# EAGLE design ADS7822 (EAGLE 6.5.0)

## Sheet 1 of 2

## Sheet 2 of 2
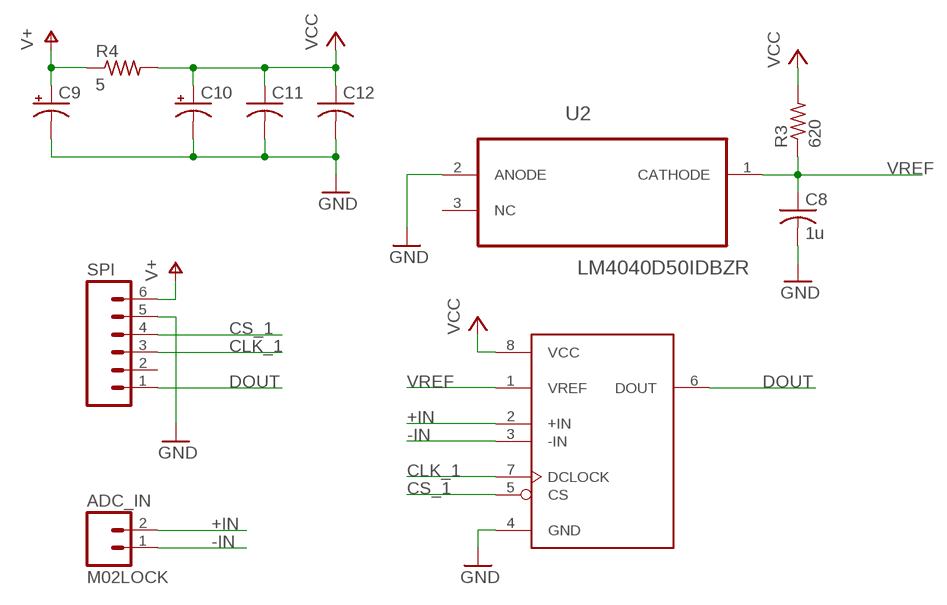
[diagram p0: schematic, sheet 2]

### Parts
ADC_IN  M02LOCK  [1X02_LOCK]
C8  1u  C-USC0805  [C0805]
C9  CPOL-US  [SMD_6.6X6.6]
C10  CPOL-US  [SMD_6.6X6.6]
C11  C-USC0805  [C0805]
C12  C-USC0805  [C0805]
R3  620  R-US_R0805  [R0805]
R4  5  R-US_R1206  [R1206]
SPI  M06LOCK  [1X06_LOCK]
U2  LM4040D50IDBZR  [SOT95P237X112-3N]
U$3  ADS7822  [SO-08]

### Nets
+IN: ADC_IN.2 U$3.2(+IN)
-IN: ADC_IN.1 U$3.3(-IN)
CLK_1: SPI.3 U$3.7(DCLOCK)
CS_1: SPI.4 U$3.5(CS)
DOUT: SPI.1 U$3.6(DOUT)
GND: C8.2 C9.- C10.- C11.2 C12.2 SPI.5 U2.2(ANODE) U$3.4(GND)
V+: C9.+ R4.1 SPI.6
VCC: C10.+ C11.1 C12.1 R3.2 R4.2 U$3.8(VCC)
VREF: C8.1 R3.1 U2.1(CATHODE) U$3.1(VREF)
Unconnected: SPI.2 U2.3(NC)

## Library data of the parts
ADC_IN = SparkFun-Connectors:M02: Standard 2-pin 0.1" header. Use with - straight break away headers ( PRT-00116) - right angle break away headers (PRT-00553) - swiss pins (PRT-00743) - machine pins (PRT-00117) - female headers (PRT-00115) Molex polarized connector foot print use with: PRT-08233 with associated crimp pins and housings. 2.54_SCREWTERM for use with PRT-10571. 3.5mm Screw Terminal footprints for PRT-08084 5mm Screw Terminal footprints for use with PRT-08432
C8 C11 C12 = rcl:C-US: CAPACITOR, American symbol
C9 C10 = rcl:CPOL-US: POLARIZED CAPACITOR, American symbol
R3 R4 = rcl:R-US_: RESISTOR, American symbol
SPI = SparkFun-Connectors:M06: Header 6 Standard 6-pin 0.1" header. Use with straight break away headers (SKU : PRT-00116), right angle break away headers (PRT-00553), swiss pins (PRT-00743), machine pins (PRT-00117), and female headers (PRT-00115). Molex polarized connector foot print use with SKU : PRT-08094 with associated crimp pins and housings. NOTES ON THE VARIANTS LOCK and LOCK_LONGPADS... This footprint was designed to help hold the alignment of a through-hole component (i.e. 6-pin header) while soldering it into place. You may notice that each hole has been shifted either up or down by 0.005 of an inch from it's more standard position (which is a perfectly straight line). This slight alteration caused the pins (the squares in the middle) to touch the edges of the holes. Because they are alternating, it causes a "brace" to hold the component in place. 0.005 has proven to be the perfect amount of "off-center" position when using our standard breakaway headers. Although looks a little odd when you look at the bare footprint, once you have a header in there, the alteration is very hard to notice. Also,if you push a header all the way into place, it is covered up entirely on the bottom side. This idea of altering the position of holes to aid alignment will be further integrated into the Sparkfun Library for other footprints. It can help hold any component with 3 or more connection pins.
U2 = LM4040-5.0_SOIC:LM4040D50IDBZR: PRECISION MICROPOWER SHUNT VOLTAGE REFERENCE; MPN: LM4040D50IDBZR; OC_FARNELL: 1652239; OC_NEWARK: 43K3367; PACKAGE: 3-SOT-23; SUPPLIER: TEXAS INSTRUMENTS
U$3 = texas:ADS7822

## Board
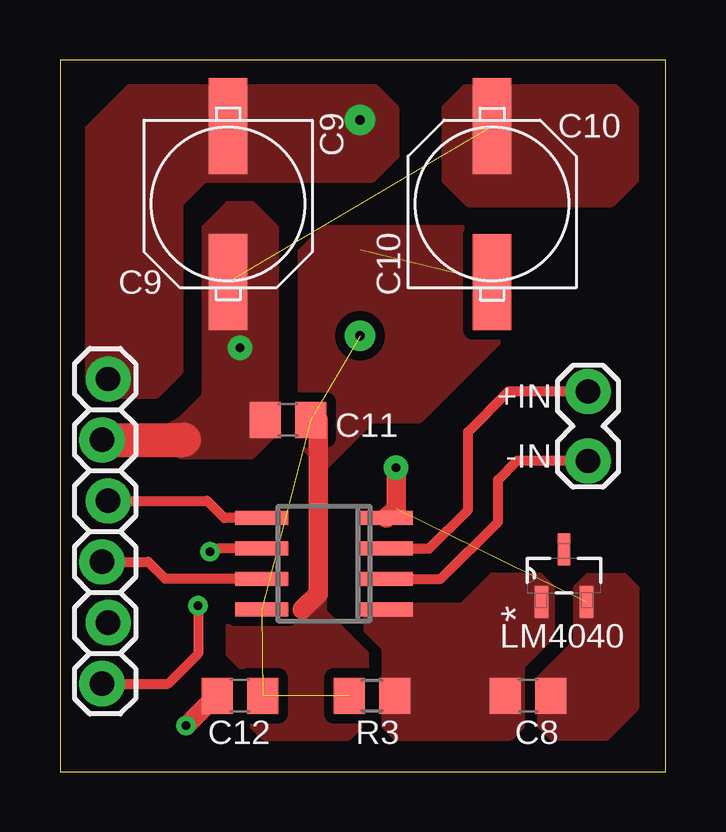
[diagram p1: board, top side]
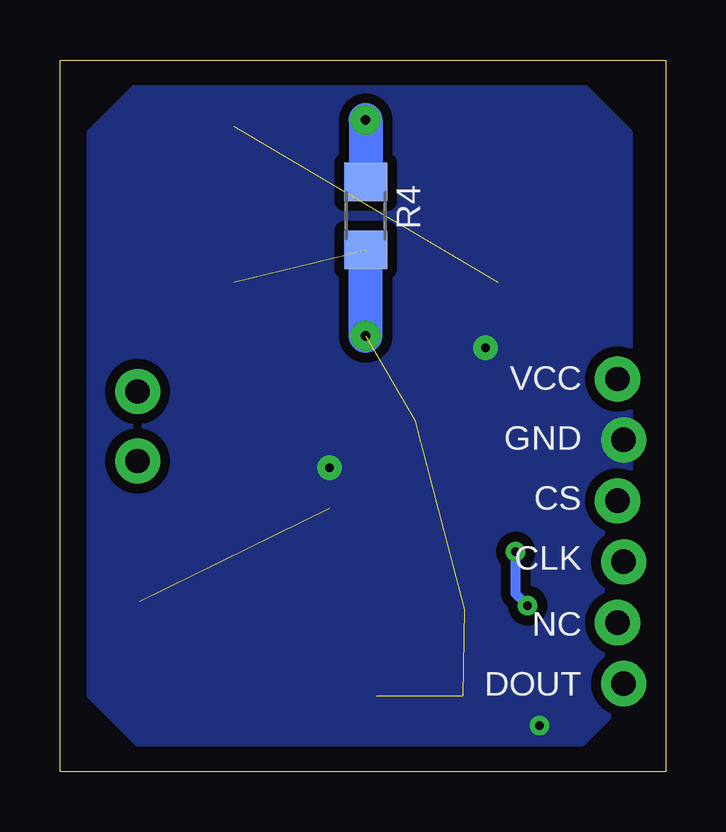
[diagram p2: board, bottom side, seen from below]

Size 25.23 x 29.68 mm. Coordinates in mm from the lower left corner, seen from the top.
Outline: 0,0 25.23,0 25.23,29.68 0,29.68 0,0
Copper layers (1*16): Top 0.035mm / dielectric 1.5mm / Bottom 0.035mm
Design rules "default": minimum track width 10mil, minimum drill 24mil, track to track 8mil, track to pad 8mil, pad to pad 8mil, via to via 8mil, smd to smd 8mil, copper to edge 40mil, drill to drill 8mil, minimum pad ring 10mil, minimum via ring 8mil, stop-mask expansion 4mil, vias tented up to drill 0mil, thermal gap 10mil

### Footprints (pad centres in the part's own frame; a part is rotated, then mirrored left to right if it is on the bottom)
1X02_LOCK = drill 1.016 pad 1.88: 1 -0.178,0; 2 2.718,0
C0805 = smd 1.3 x 1.5: 1 -0.95,0; 2 0.95,0
SMD_6.6X6.6 = smd 4 x 1.6: + -3.25,0; - 3.25,0
R0805 = smd 1.3 x 1.5: 1 -0.95,0; 2 0.95,0
R1206 = smd 1.6 x 1.803: 1 -1.422,0; 2 1.422,0
1X06_LOCK = drill 1.016 pad 1.88: 1 0,0; 2 2.54,-0.254; 3 5.08,0; 4 7.62,-0.254; 5 10.16,0; 6 12.7,-0.254
SOT95P237X112-3N = smd 1.321 x 0.559: 1 -1.092,0.94; 2 -1.092,-0.94 | smd 1.321 x 0.508: 3 1.092,0
SO-08 = smd 0.6 x 2.2: 1 -1.905,-2.6; 2 -0.635,-2.6; 3 0.635,-2.6; 4 1.905,-2.6; 5 1.905,2.6; 6 0.635,2.6; 7 -0.635,2.6; 8 -1.905,2.6

### Placement (x,y rotation side)
ADC_IN  22,15.68 270 top
C8  19.5,3.18 0 top
C9  7,23.68 270 top
C10  18,23.68 90 top
C11  9.5,14.68 180 top
C12  7.5,3.18 180 top
R3  13,3.18 180 top
R4  12.5,23.18 270 bottom
SPI  1.75,3.68 90 top
U2  21,8.18 90 top
U$3  11,8.68 90 top

### Tracks (layer width: path | path; a pad name or v marks a point on that pad's centre or on a via)
+7V
  Top 0.813: 10.1,6.78 10.75,7.43 10.75,14.68
  pour Top (isolate 0.406, no thermals): 23,22.68 11,22.68 10,21.68 10,13.68 11,12.68 13,14.68 15,14.68 18.5,18.18 23,18.18 24,19.18 24,21.68
  pour Top (isolate 0.406, no thermals): 10.75,7.43 10.25,6.93 7.5,6.93 7,6.43 7,4.93 7.75,4.18 7.75,2.18 8.5,1.43 12,1.43 12.75,2.18 12.75,4.93 11,6.68 11,7.43
+IN
  Top 0.406: U$3.2 15.87,8.05 18.25,10.43 18.25,12.18 19.03,12.96 ADC_IN.2
-IN
  Top 0.406: U$3.3 15.38,9.32 17,10.93 17,14.18 18.68,15.86 ADC_IN.1
CLK_1
  Top 0.406: U$3.7 4.38,8.05 3.67,8.76 SPI.3
CS_1
  Top 0.406: SPI.4 6.13,11.3 6.84,10.59 U$3.5
DOUT  (via drill 0.35 pad 0.81)
  Top 0.406: U$3.6 6.62,9.32 v6.25,9.18 | SPI.1 4.5,3.68 5.75,4.93 v5.75,6.93
  Bottom 0.406: v5.75,6.93 6.25,7.43 v6.25,9.18
GND  (via drill 0.35 pad 0.81, 0.35 pad 1.02)  (2 unrouted)
  Top 0.813: C12.2 6.5,3.18 v5.25,1.93 | v14,12.68 14,10.98 U$3.4
  Top 1.422: SPI.5 5.16,13.84
  other vias: 7.5,17.68
  pour Bottom (isolate 0.406, no thermals): 22,28.68 3.5,28.68 1.5,26.68 1.5,3.18 3.5,1.18 22,1.18 24,3.18 24,26.68
  pour Top (isolate 0.406, no thermals): 22,28.68 17,28.68 16,27.68 16,24.68 17,23.68 23,23.68 24,24.68 24,27.68 23,28.68
  pour Top (isolate 0.406, no thermals): 8,23.68 7,23.68 6,22.68 6,15.68 5,14.68 4,14.18 5,13.18 8,13.18 9,14.18 9,22.68
  pour Top (isolate 0.406, no thermals): 21.5,5.68 21.5,7.68 22,8.18 23.5,8.18 24,7.68 24,2.68 22.75,1.43 20.5,1.43 20,1.93 20,3.93 21.5,5.43
V+  (via drill 0.4 pad 1.27)
  Bottom 1.422: v12.5,27.18 R4.1
  pour Top (isolate 0.406, no thermals): 13,28.68 14,27.68 14,25.68 13,24.68 6,24.68 5,23.68 5,16.68 4,15.68 2,15.68 1,16.68 1,26.68 3,28.68
VCC  (via drill 0.4 pad 1.27)  (5 unrouted)
  Bottom 1.422: v12.5,18.18 R4.2
VREF
  pour Top (isolate 0.406, no thermals): 20.5,5.68 20.5,7.68 20,8.18 18,8.18 16.75,6.93 13.25,6.93 12.75,6.43 12.75,5.93 13.5,5.18 13.5,1.93 14,1.43 18.75,1.43 19.25,1.93 19.25,4.43

### Text on the board
tPlace: C10 | C9 | +IN | -IN | LM4040
bPlace: VCC | GND | CS | CLK | NC | DOUT